# EAGLE design NEWNU32 (EAGLE 8.7.1)
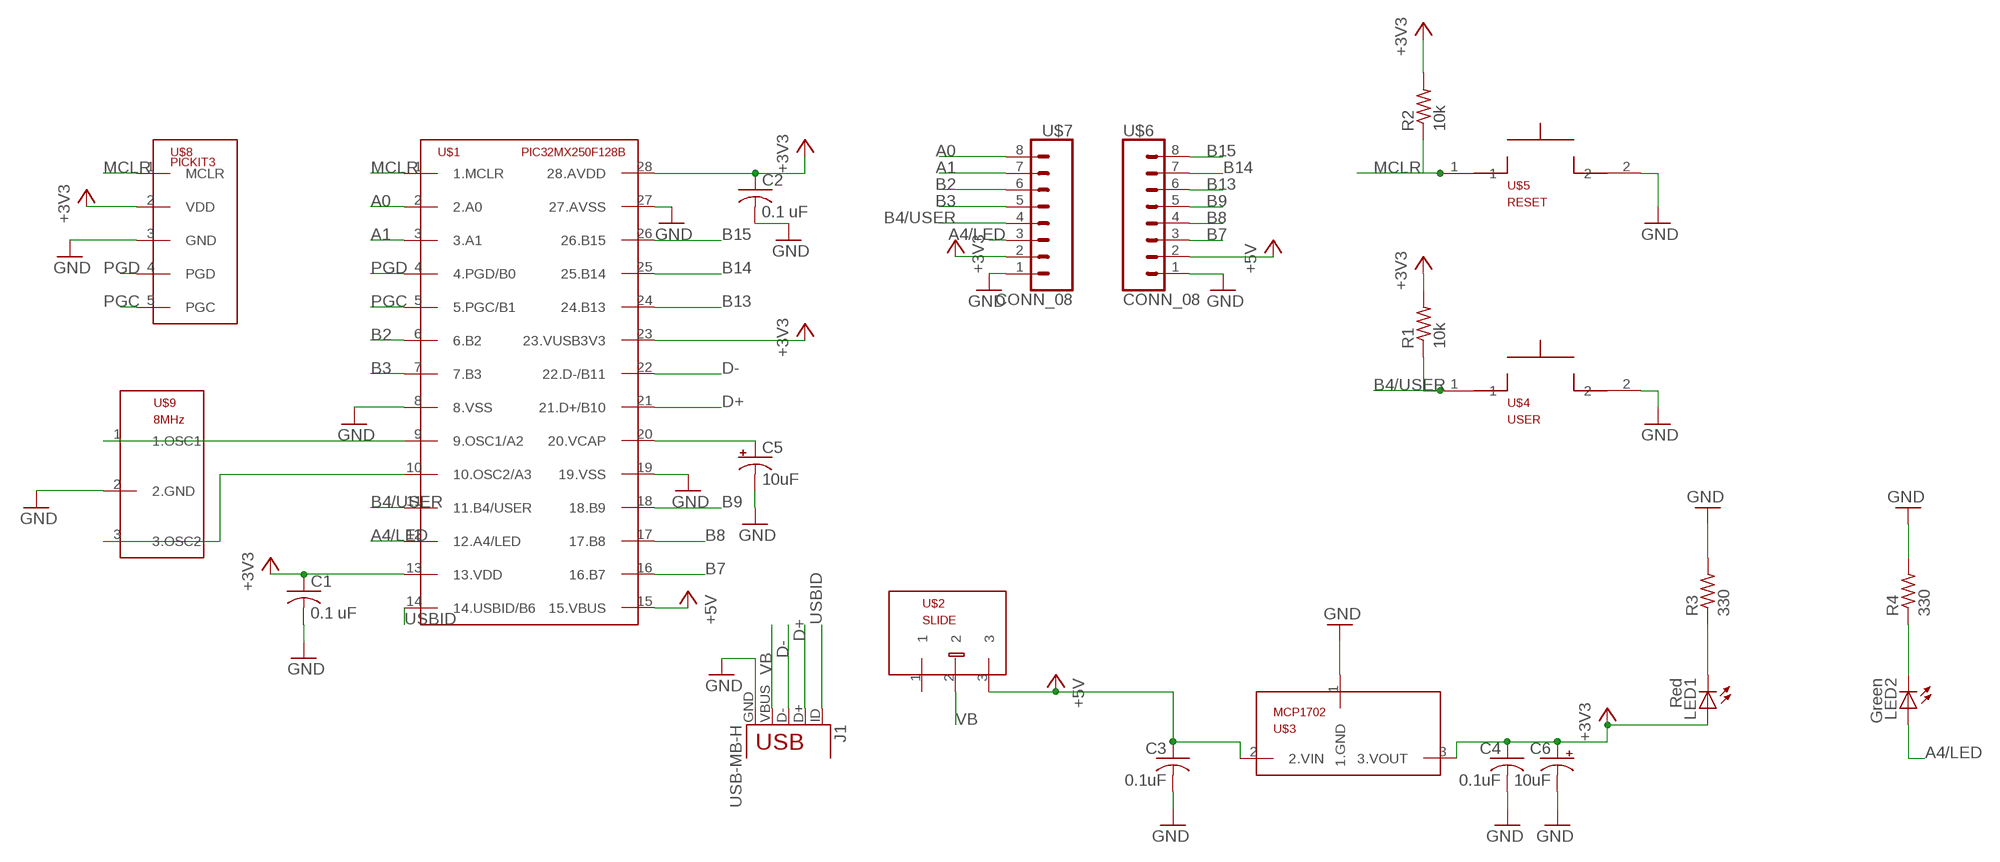
[diagram p0: schematic, sheet 1]

## Parts
C1  0.1 uF  C-US025-025X050  [C025-025X050]
C2  0.1 uF  C-US025-025X050  [C025-025X050]
C3  0.1uF  C-US025-025X050  [C025-025X050]
C4  0.1uF  C-US025-025X050  [C025-025X050]
C5  10uF  CPOL-USB45181B  [B45181B]
C6  10uF  CPOL-USB45181B  [B45181B]
J1  USB-MB-H  [USB-MB-H]
LED1  Red  LED3MM  [LED3MM]
LED2  Green  LED3MM  [LED3MM]
R1  10k  R-US_0207/10  [0207/10]
R2  10k  R-US_0207/10  [0207/10]
R3  330  R-US_0207/10  [0207/10]
R4  330  R-US_0207/10  [0207/10]
U$1  PIC32MX250F128B  [DIL28-3]
U$2  SLIDE  [SLIDE]
U$3  MCP1702  [TO92]
U$4  USER  PB  [PB]
U$5  RESET  PB  [PB]
U$6  CONN_08  [1X08]
U$7  CONN_08  [1X08]
U$8  PICKIT3  [1X05]
U$9  8MHz  OSC  [OSC]

## Nets
+3V3: C1.1 C2.1 C4.1 C6.+ LED1.A R1.2 R2.2 U$1.13(13.VDD) U$1.23(23.VUSB3V3) U$1.28(28.AVDD) U$3.3(3.VOUT) U$7.2 U$8.2(VDD)
+5V: C3.1 U$1.15(15.VBUS) U$2.3 U$3.2(2.VIN) U$6.2
A0: U$1.2(2.A0) U$7.8
A1: U$1.3(3.A1) U$7.7
A4/LED: LED2.A U$1.12(12.A4/LED) U$7.3
B2: U$1.6(6.B2) U$7.6
B3: U$1.7(7.B3) U$7.5
B4/USER: R1.1 U$1.11(11.B4/USER) U$4.1 U$7.4
B7: U$1.16(16.B7) U$6.3
B8: U$1.17(17.B8) U$6.4
B9: U$1.18(18.B9) U$6.5
B13: U$1.24(24.B13) U$6.6
B14: U$1.25(25.B14) U$6.7
B15: U$1.26(26.B15) U$6.8
D+: J1.D+ U$1.21(21.D+/B10)
D-: J1.D- U$1.22(22.D-/B11)
GND: C1.2 C2.2 C3.2 C4.2 C5.- C6.- J1.GND R3.2 R4.2 U$1.8(8.VSS) U$1.19(19.VSS) U$1.27(27.AVSS) U$3.1(1.GND) U$4.2 U$5.2 U$6.1 U$7.1 U$8.3(GND) U$9.2(2.GND)
MCLR: R2.1 U$1.1(1.MCLR) U$5.1 U$8.1(MCLR)
N$1: LED2.K(C) R4.1
N$2: LED1.K(C) R3.1
N$3: U$1.9(9.OSC1/A2) U$9.1(1.OSC1)
N$4: U$1.10(10.OSC2/A3) U$9.3(3.OSC2)
N$6: C5.+ U$1.20(20.VCAP)
PGC: U$1.5(5.PGC/B1) U$8.5(PGC)
PGD: U$1.4(4.PGD/B0) U$8.4(PGD)
USBID: J1.ID U$1.14(14.USBID/B6)
VB: J1.VBUS U$2.2
Unconnected: U$2.1

## Library data of the parts
C1-C4 = 433:C-US: CAPACITOR, American symbol
C5 C6 = 433:CPOL-US: POLARIZED CAPACITOR, American symbol
J1 = 433:USB: USB Connectors USB-B-PTH is fully proven SKU : PRT-00139/CONN-08278 USB-miniB is fully proven SKU : PRT-00587 USB-A-PCB is untested. USB-A-H is throughly reviewed, but untested. Spark Fun Electronics SKU : PRT-00437 USB-B-SMT is throughly reviewed, but untested. Needs silkscreen touching up. USB-A-S has not been used/tested USB-MB-H has not been used/tested USB-MICROB has been used. CONN-09505
LED1 LED2 = led:LED: LED OSRAM: - CHIPLED LG R971, LG N971, LY N971, LG Q971, LY Q971, LO R971, LY R971 LH N974, LH R974 LS Q976, LO Q976, LY Q976 LO Q996 - Hyper CHIPLED LW Q18S LB Q993, LB Q99A, LB R99A - SideLED LS A670, LO A670, LY A670, LG A670, LP A670 LB A673, LV A673, LT A673, LW A673 LH A674 LY A675 LS A676, LA A676, LO A676, LY A676, LW A676 LS A679, LY A679, LG A679 - Hyper Micro SIDELED® LS Y876, LA Y876, LO Y876, LY Y876 LT Y87S - SmartLED LW L88C, LW L88S LB L89C, LB L89S, LG L890 LS L89K, LO L89K, LY L89K LS L896, LA L896, LO L896, LY L896 - TOPLED LS T670, LO T670, LY T670, LG T670, LP T670 LSG T670, LSP T670, LSY T670, LOP T670, LYG T670 LG T671, LOG T671, LSG T671 LB T673, LV T673, LT T673, LW T673 LH T674 LS T676, LA T676, LO T676, LY T676, LB T676, LH T676, LSB T676, LW T676 LB T67C, LV T67C, LT T67C, LS T67K, LO T67K, LY T67K, LW E67C LS E67B, LA E67B, LO E67B, LY E67B, LB E67C, LV E67C, LT E67C LW T67C LS T679, LY T679, LG T679 LS T770, LO T770, LY T770, LG T770, LP T770 LB T773, LV T773, LT T773, LW T773 LH T774 LS E675, LA E675, LY E675, LS T675 LS T776, LA T776, LO T776, LY T776, LB T776 LHGB T686 LT T68C, LB T68C - Hyper Mini TOPLED® LB M676 - Mini TOPLED Santana® LG M470 LS M47K, LO M47K, LY M47K Source: http://www.osram.convergy.de LUXEON: - LUMILED® LXK2-PW12-R00, LXK2-PW12-S00, LXK2-PW14-U00, LXK2-PW14-V00 LXK2-PM12-R00, LXK2-PM12-S00, LXK2-PM14-U00 LXK2-PE12-Q00, LXK2-PE12-R00, LXK2-PE12-S00, LXK2-PE14-T00, LXK2-PE14-U00 LXK2-PB12-K00, LXK2-PB12-L00, LXK2-PB12-M00, LXK2-PB14-N00, LXK2-PB14-P00, LXK2-PB14-Q00 LXK2-PR12-L00, LXK2-PR12-M00, LXK2-PR14-Q00, LXK2-PR14-R00 LXK2-PD12-Q00, LXK2-PD12-R00, LXK2-PD12-S00 LXK2-PH12-R00, LXK2-PH12-S00 LXK2-PL12-P00, LXK2-PL12-Q00, LXK2-PL12-R00 Source: www.luxeon.com KINGBRIGHT: KA-3528ASYC Source: www.kingbright.com
R1-R4 = 433:R-US_: RESISTOR, American symbol
U$1 = 433:PIC32MX250F128B
U$2 = 433:SLIDE
U$3 = 433:MCP1702
U$4 U$5 = 433:PB
U$6 U$7 = 433:CONN_08
U$8 = 433:PICKIT3
U$9 = 433:OSC

## Board
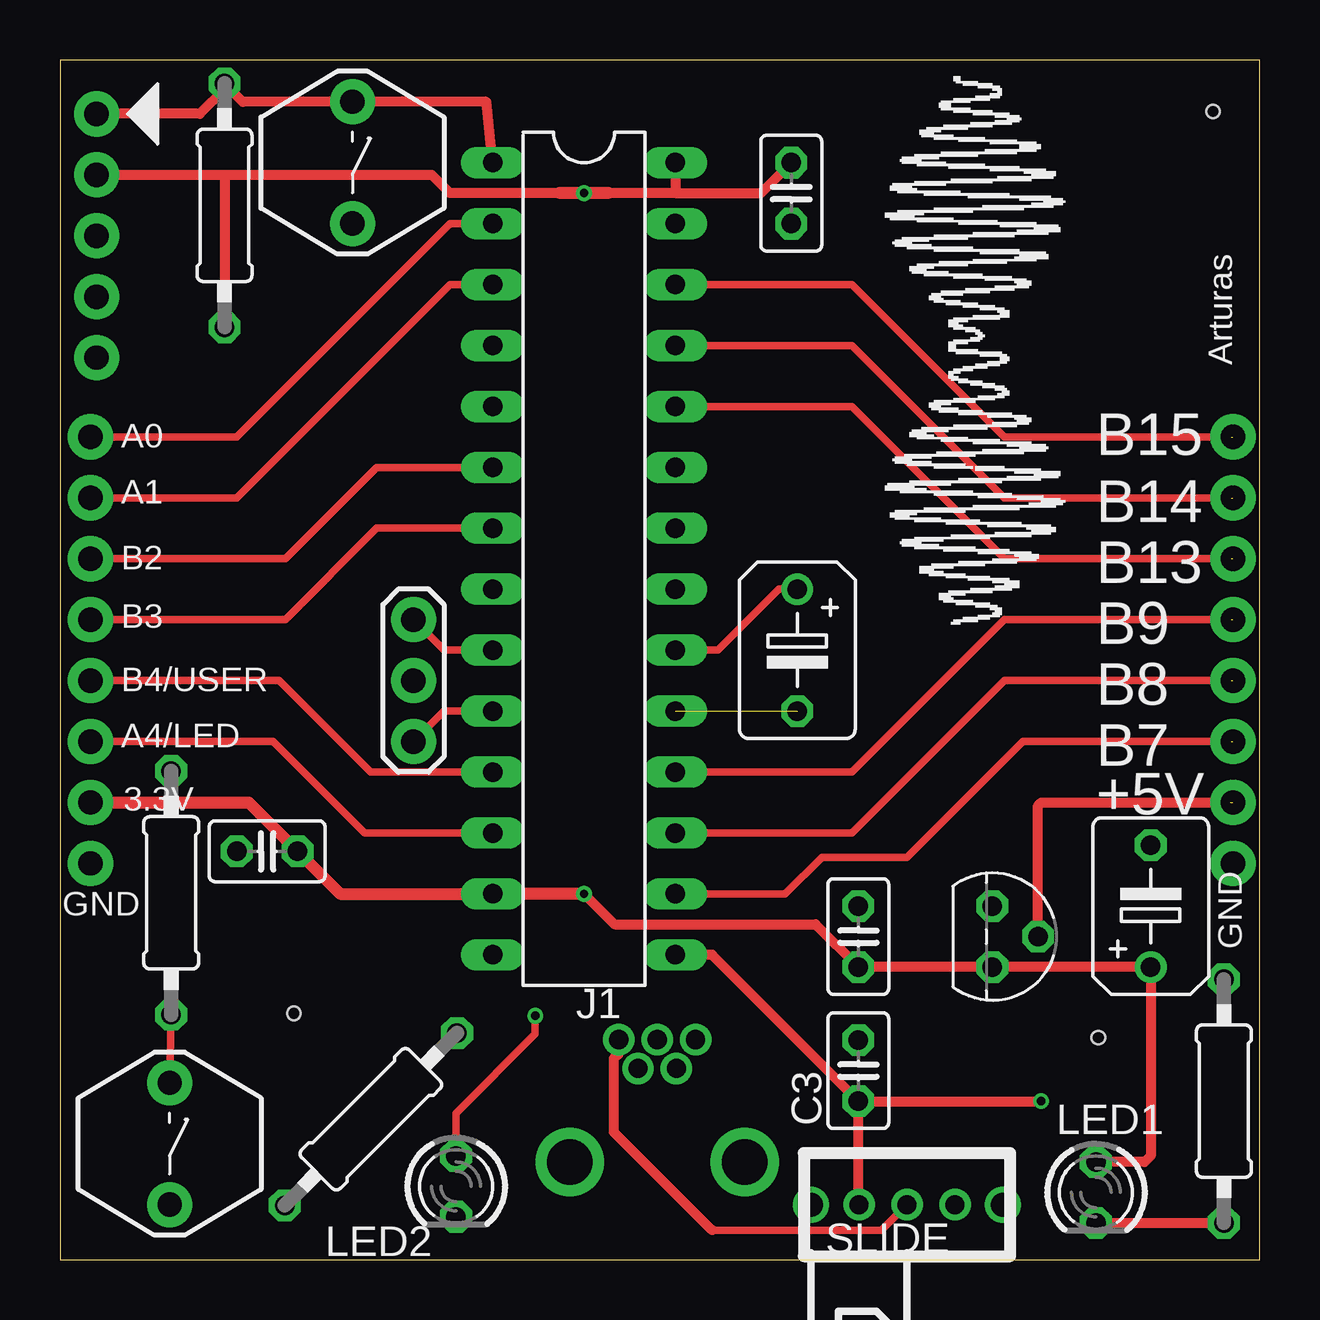
[diagram p1: board, top side]
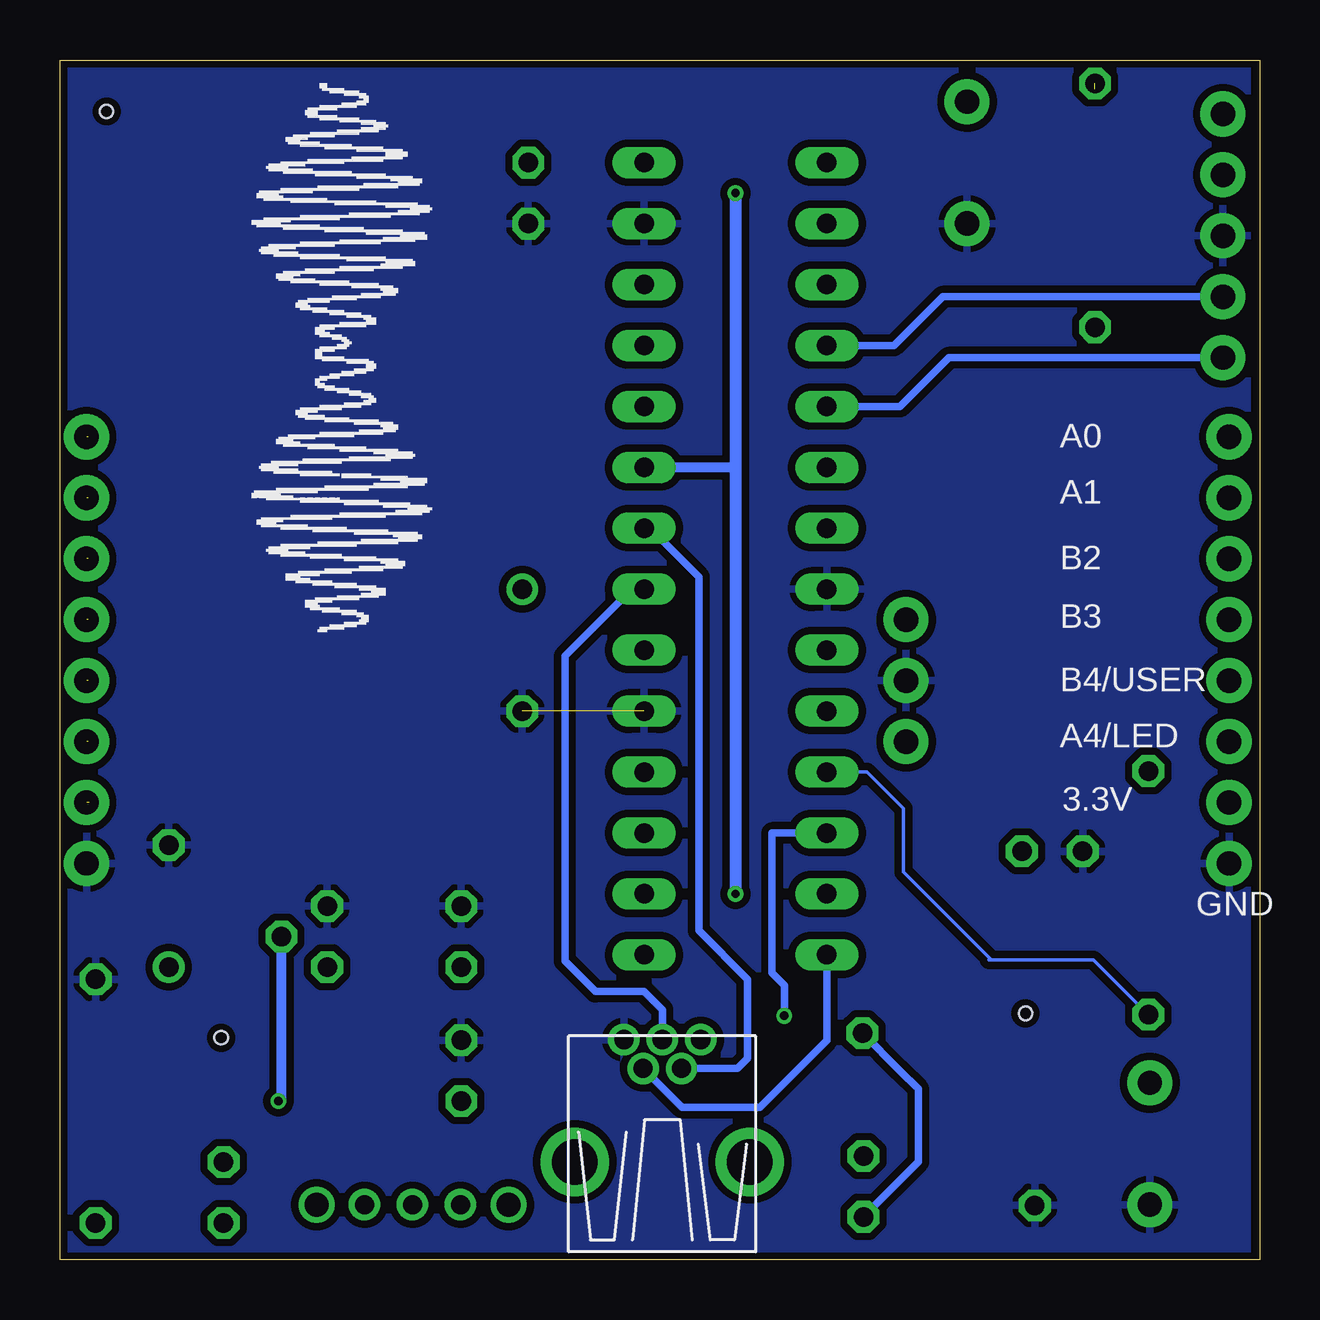
[diagram p2: board, bottom side, seen from below]

Size 50 x 50 mm. Coordinates in mm from the lower left corner, seen from the top.
Outline: 0,0 50,0 50,50 0,50 0,0
Copper layers (1*16): Top 0.035mm / dielectric 1.5mm / Bottom 0.035mm
Design rules "SeeedStudio_2layer_DRU_no_angle_20140221": minimum track width 6mil, minimum drill 12mil, track to track 6mil, track to pad 6mil, pad to pad 6mil, via to via 6mil, smd to smd 0mil, copper to edge 10mil, drill to drill 10mil, minimum pad ring 10mil, minimum via ring 6mil, stop-mask expansion 2mil, vias tented up to drill 100mil, thermal gap 10mil
Holes 0.55 mm at 9.75,10.26 43.28,9.25 48.06,47.85

### Footprints (pad centres in the part's own frame; a part is rotated, then mirrored left to right if it is on the bottom)
C025-025X050 = drill 0.813 octagon: 1 -1.27,0; 2 1.27,0
B45181B = drill 0.813: + -2.54,0 | drill 0.813 octagon: - 2.54,0
USB-MB-H = drill 0.8: D+ 5.1,0; D- 3.9,0.8; GND 5.1,-1.6; ID 3.9,-0.8; VBUS 5.1,1.6 | drill 1.9: P$6 0,-3.65; P$7 0,3.65
LED3MM = drill 0.813 octagon: A -1.27,0; K 1.27,0
0207/10 = drill 0.813 octagon: 1 -5.08,0; 2 5.08,0
DIL28-3 = drill 0.813 long: 1 -16.51,-3.81; 2 -13.97,-3.81; 3 -11.43,-3.81; 4 -8.89,-3.81; 5 -6.35,-3.81; 6 -3.81,-3.81; 7 -1.27,-3.81; 8 1.27,-3.81; 9 3.81,-3.81; 10 6.35,-3.81; 11 8.89,-3.81; 12 11.43,-3.81; 13 13.97,-3.81; 14 16.51,-3.81; 15 16.51,3.81; 16 13.97,3.81; 17 11.43,3.81; 18 8.89,3.81; 19 6.35,3.81; 20 3.81,3.81; 21 1.27,3.81; 22 -1.27,3.81; 23 -3.81,3.81; 24 -6.35,3.81; 25 -8.89,3.81; 26 -11.43,3.81; 27 -13.97,3.81; 28 -16.51,3.81
SLIDE = drill 0.8: 1 -2,0; 2 0,0; 3 2,0 | drill 1: P$1 -4,0; P$2 4,0
TO92 = drill 0.813 octagon: 1 -1.27,0; 2 0,1.905; 3 1.27,0
PB = drill 1.016 pad 1.88: 1 -2.54,0; 2 2.54,0
1X08 = drill 1.016 pad 1.88: 1 0,0; 2 2.54,0; 3 5.08,0; 4 7.62,0; 5 10.16,0; 6 12.7,0; 7 15.24,0; 8 17.78,0
1X05 = drill 1.016 pad 1.88: 1 0,0; 2 2.54,0; 3 5.08,0; 4 7.62,0; 5 10.16,0
OSC = drill 1.016 pad 1.88: 1 -2.54,0; 2 0,0; 3 2.54,0

### Placement (x,y rotation side)
C1  8.64,17.02 180 top
C2  30.48,44.45 270 top
C3  33.27,7.87 90 top
C4  33.27,13.46 90 top
C5  30.73,25.4 270 top
C6  45.47,14.73 90 top
J1  24.89,4.06 90 top
LED1  43.18,2.79 270 top
LED2  16.51,3.05 270 top
R1  4.63,15.28 90 top
R2  6.86,43.94 270 top
R3  48.51,6.6 90 top
R4  12.96,5.85 225 top
U$1  21.84,29.21 270 top
U$2  35.31,2.29 180 top
U$3  38.86,13.46 270 top
U$4  4.57,4.83 270 top
U$5  12.19,45.72 270 top
U$6  48.9,16.51 90 top
U$7  1.27,16.51 90 top
U$8  1.52,47.75 270 top
U$9  14.73,24.13 270 top

### Tracks (layer width: path | path; a pad name or v marks a point on that pad's centre or on a via)
+3V3  (via drill 0.35)
  Top 0.406: U$8.2 6.86,45.21 | 6.86,45.21 R2.2 | 6.86,45.21 15.49,45.21 16.26,44.45 20.83,44.45 | 25.65,44.45 29.21,44.45 C2.1 | 25.65,44.45 22.86,44.45 | LED1.A 45.21,4.06 45.47,4.32 C6.+ U$3.3 C4.1 31.5,13.97 23.11,13.97 v21.84,15.24 | U$1.28 25.65,44.45
  Top 0.508: 22.86,44.45 v21.84,44.45 20.83,44.45 | v21.84,15.24 U$1.13 11.68,15.24 C1.1 7.87,19.05 4.57,19.05 | U$7.2 4.57,19.05 | R1.2 4.63,19.11 4.57,19.05
  Bottom 0.406: 21.84,33.02 U$1.23
  Bottom 0.508: v21.84,44.45 21.84,33.02 v21.84,15.24
+5V  (via drill 0.35)  (1 unrouted)
  Top 0.406: U$2.3 33.27,2.32 C3.1 | U$3.2 40.77,18.92 40.89,19.05 48.78,19.05 | C3.1 27.18,12.7 U$1.15 | C3.1 v40.89,6.6
  Bottom 0.406: v40.89,6.6 40.77,6.73 U$3.2
A0
  Top 0.305: U$1.2 16.26,43.18 7.37,34.29 U$7.8
A1
  Top 0.305: U$1.3 16.26,40.64 7.37,31.75 U$7.7
A4/LED  (via drill 0.35)
  Top 0.305: U$7.3 8.89,21.59 12.7,17.78 U$1.12 | v19.81,10.16 19.81,9.4 16.51,6.1 LED2.A
  Bottom 0.305: U$1.12 20.32,17.78 20.32,11.94 19.81,11.43 v19.81,10.16
B2
  Top 0.305: U$7.6 9.4,29.21 13.21,33.02 U$1.6
B3
  Top 0.305: U$7.5 9.4,26.67 13.21,30.48 U$1.7
B4/USER
  Top 0.305: U$4.1 R1.1 | U$7.4 9.14,24.13 12.95,20.32 U$1.11
  Bottom 0.152: R1.1 6.93,12.5 11.18,12.5 | 11.18,12.5 11.28,12.5 | 11.18,12.5 14.83,16.15 14.83,18.8 16.36,20.32 U$1.11
B7  (1 unrouted)
  Top 0.305: U$1.16 30.23,15.24 31.75,16.76 35.31,16.76 40.13,21.59 48.83,21.59
B8  (1 unrouted)
  Top 0.305: U$1.17 33.02,17.78 39.37,24.13 48.83,24.13
B9  (1 unrouted)
  Top 0.305: 48.83,26.67 48.26,26.67 39.37,26.67 33.02,20.32 U$1.18
B13  (1 unrouted)
  Top 0.305: U$1.24 33.02,35.56 39.37,29.21 48.83,29.21
B14  (1 unrouted)
  Top 0.305: U$1.25 33.02,38.1 39.37,31.75 48.83,31.75
B15  (1 unrouted)
  Top 0.305: 48.83,34.29 39.37,34.29 33.02,40.64 U$1.26
D+
  Bottom 0.305: J1.D+ 24.89,10.41 25.65,11.18 27.69,11.18 28.96,12.45 28.96,25.15 26.16,27.94 U$1.21
D-
  Bottom 0.305: J1.D- 21.75,7.96 21.34,8.38 21.34,11.68 23.37,13.72 23.37,28.45 25.4,30.48 U$1.22
GND  (1 unrouted)
  pour Bottom (isolate 0.305): 0.51,49.78 0.51,0.25 0.76,0 49.78,0 49.78,49.53 49.53,49.78
MCLR  (1 unrouted)
  Top 0.406: U$1.1 17.78,48.26 U$5.1 7.62,48.26 7.1,48.78 6.86,48.78 5.83,47.75 U$8.1
N$1
  Bottom 0.305: LED2.K 14.22,4.06 14.22,7.11 14.99,7.87 R4.1
  Bottom 0.508: R4.1
N$2
  Top 0.406: LED1.K R3.1
N$3
  Top 0.305: U$9.1 16,25.4 U$1.9
N$4
  Top 0.305: U$9.3 16,22.86 U$1.10
N$6
  Top 0.305: U$1.20 27.43,25.4 29.97,27.94 C5.+
PGC
  Bottom 0.305: U$8.5 12.95,37.59 14.99,35.56 U$1.5
PGD
  Bottom 0.305: U$1.4 15.24,38.1 13.21,40.13 U$8.4
USBID
  Bottom 0.305: J1.ID 24.08,6.35 20.83,6.35 18.03,9.14 U$1.14
VB
  Top 0.305: 27.18,1.22 34.24,1.22 U$2.2
  Top 0.406: J1.VBUS 23.29,8.59 23.08,8.38 23.08,5.32 27.18,1.22

### Text on the board
tPlace: Arturas | A0 | B15 | A1 | B14 | B2 | B13 | B3 | B9 | B4/USER | B8 | A4/LED | B7 | 3.3V | +5V | GND | GND
bPlace: A0 | A1 | B2 | B3 | B4/USER | A4/LED | 3.3V | GND